# EAGLE design untitled (EAGLE 7.5.0)
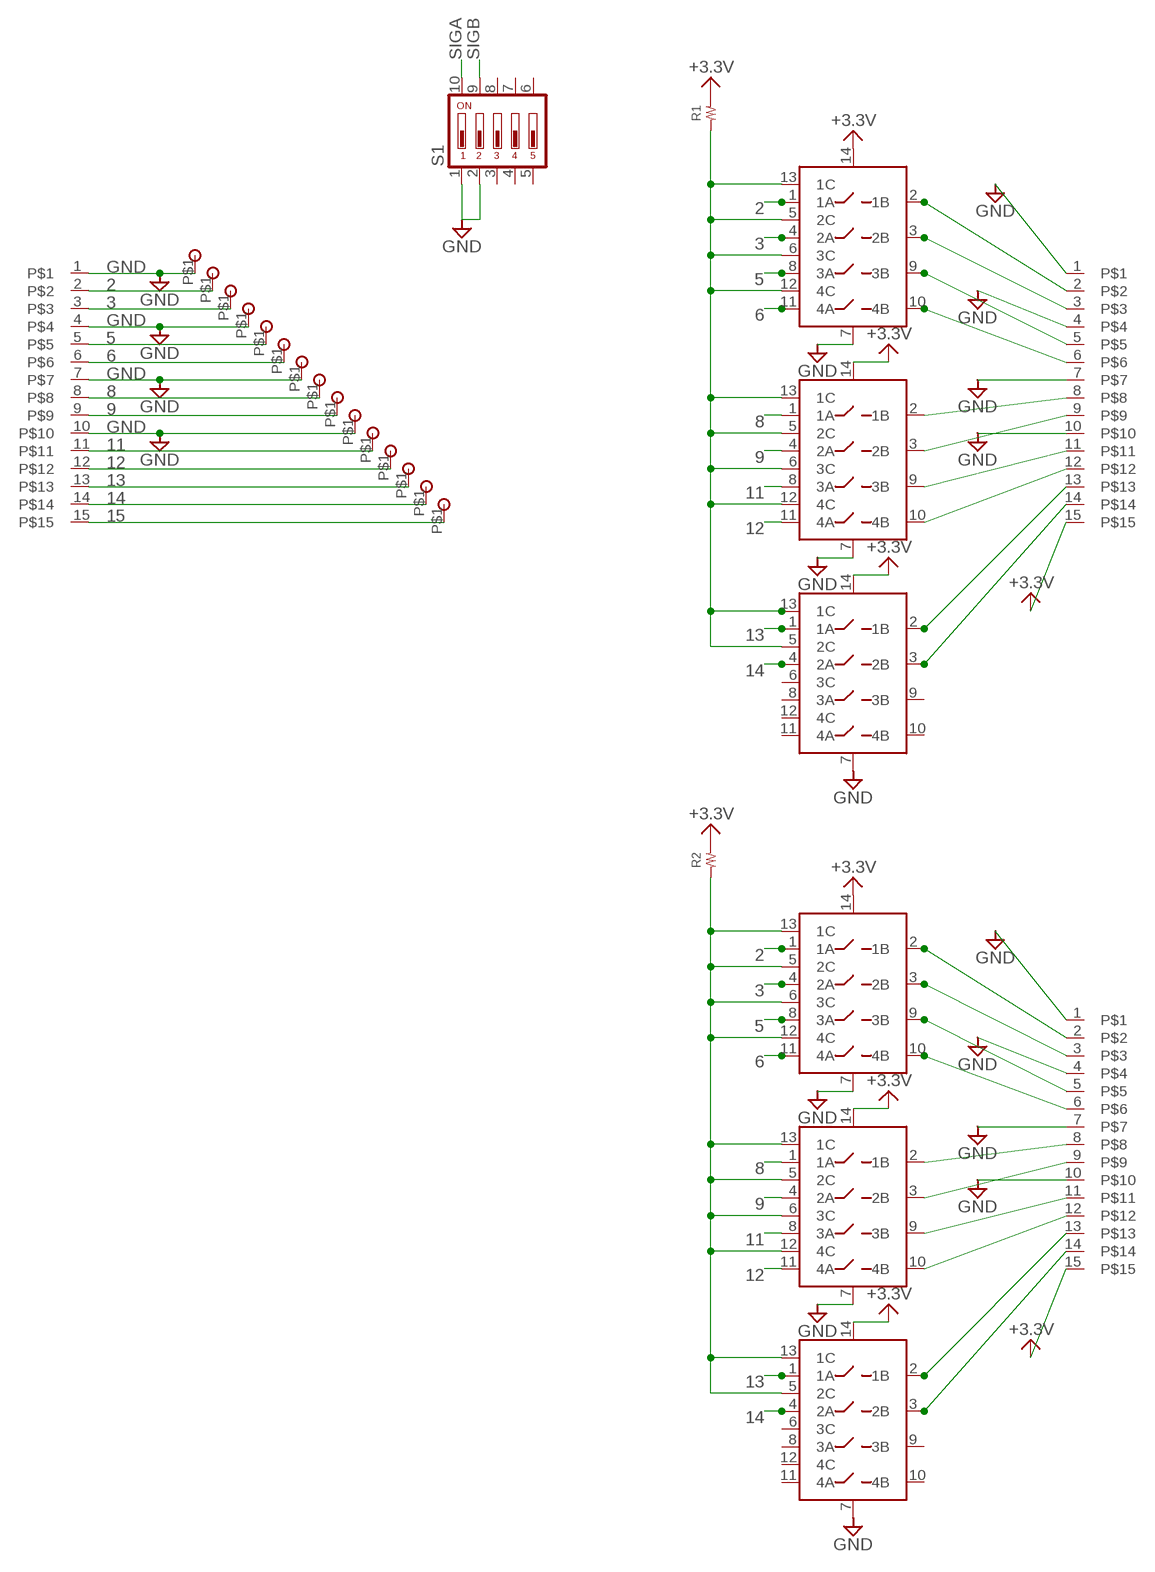
[diagram p0: schematic, sheet 1]

## Parts
A1  SN74HC4066  [DIL14]
A2  SN74HC4066  [DIL14]
A3  SN74HC4066  [DIL14]
A4  SN74HC4066  [DIL14]
A5  SN74HC4066  [DIL14]
A6  SN74HC4066  [DIL14]
C1  FMZ15  [FMZ15]
C2  FMZ15  [FMZ15]
R1  RESISTOR__SMD  [1608]
R2  RESISTOR__SMD  [1608]
RAS  FMZ15  [FMZ15]
S1  DIP05YL  [DIP05YL]
U$4  CHECK_0.8MM  [CHECK_0.8MM]
U$5  CHECK_0.8MM  [CHECK_0.8MM]
U$6  CHECK_0.8MM  [CHECK_0.8MM]
U$7  CHECK_0.8MM  [CHECK_0.8MM]
U$8  CHECK_0.8MM  [CHECK_0.8MM]
U$9  CHECK_0.8MM  [CHECK_0.8MM]
U$10  CHECK_0.8MM  [CHECK_0.8MM]
U$11  CHECK_0.8MM  [CHECK_0.8MM]
U$12  CHECK_0.8MM  [CHECK_0.8MM]
U$13  CHECK_0.8MM  [CHECK_0.8MM]
U$14  CHECK_0.8MM  [CHECK_0.8MM]
U$15  CHECK_0.8MM  [CHECK_0.8MM]
U$16  CHECK_0.8MM  [CHECK_0.8MM]
U$17  CHECK_0.8MM  [CHECK_0.8MM]
U$18  CHECK_0.8MM  [CHECK_0.8MM]

## Nets
2: A1.1(1A) A4.1(1A) RAS.2 U$5.P$1
3: A1.4(2A) A4.4(2A) RAS.3 U$6.P$1
5: A1.8(3A) A4.8(3A) RAS.5 U$8.P$1
6: A1.11(4A) A4.11(4A) RAS.6 U$9.P$1
8: A2.1(1A) A5.1(1A) RAS.8 U$11.P$1
9: A2.4(2A) A5.4(2A) RAS.9 U$12.P$1
11: A2.8(3A) A5.8(3A) RAS.11 U$14.P$1
12: A2.11(4A) A5.11(4A) RAS.12 U$15.P$1
13: A3.1(1A) A6.1(1A) RAS.13 U$16.P$1
14: A3.4(2A) A6.4(2A) RAS.14 U$17.P$1
15: RAS.15 U$18.P$1
+3.3V: A1.14(VCC) A2.14(VCC) A3.14(VCC) A4.14(VCC) A5.14(VCC) A6.14(VCC) C1.15 C2.15 R1.2 R2.2
GND: A1.7(GND) A2.7(GND) A3.7(GND) A4.7(GND) A5.7(GND) A6.7(GND) C1.1 C1.4 C1.7 C1.10 C2.1 C2.4 C2.7 C2.10 RAS.1 RAS.4 RAS.7 RAS.10 S1.1 S1.2 U$4.P$1 U$7.P$1 U$10.P$1 U$13.P$1
N$1: A4.2(1B) C2.2
N$2: A4.3(2B) C2.3
N$3: A4.9(3B) C2.5
N$4: A5.3(2B) C2.9
N$5: A5.2(1B) C2.8
N$6: A4.10(4B) C2.6
N$7: A1.2(1B) C1.2
N$8: A1.3(2B) C1.3
N$9: A6.3(2B) C2.14
N$10: A1.9(3B) C1.5
N$11: A6.2(1B) C2.13
N$12: A5.10(4B) C2.12
N$13: A5.9(3B) C2.11
N$17: A2.3(2B) C1.9
N$18: A2.2(1B) C1.8
N$20: A1.10(4B) C1.6
N$27: A3.3(2B) C1.14
N$28: A3.2(1B) C1.13
N$29: A2.10(4B) C1.12
N$30: A2.9(3B) C1.11
SIGA: A1.5(2C) A1.6(3C) A1.12(4C) A1.13(1C) A2.5(2C) A2.6(3C) A2.12(4C) A2.13(1C) A3.5(2C) A3.13(1C) R1.1 S1.10
SIGB: A4.5(2C) A4.6(3C) A4.12(4C) A4.13(1C) A5.5(2C) A5.6(3C) A5.12(4C) A5.13(1C) A6.5(2C) A6.13(1C) R2.1 S1.9
Unconnected: A3.6(3C) A3.8(3A) A3.9(3B) A3.10(4B) A3.11(4A) A3.12(4C) A6.6(3C) A6.8(3A) A6.9(3B) A6.10(4B) A6.11(4A) A6.12(4C) S1.3 S1.4 S1.5 S1.6 S1.7 S1.8

## Library data of the parts
A1-A6 = 04_IC:SN74HC4066
C1 C2 RAS = 08_CONECTOR:FMZ15
R1 R2 = 01_R:RESISTOR__SMD
S1 = 09_1_switch:DIP05YL: DIL/CODE SWITCH; OC_FARNELL: unknown; OC_NEWARK: unknown
U$4-U$18 = 08_CONECTOR:CHECK_0.8MM

## Board
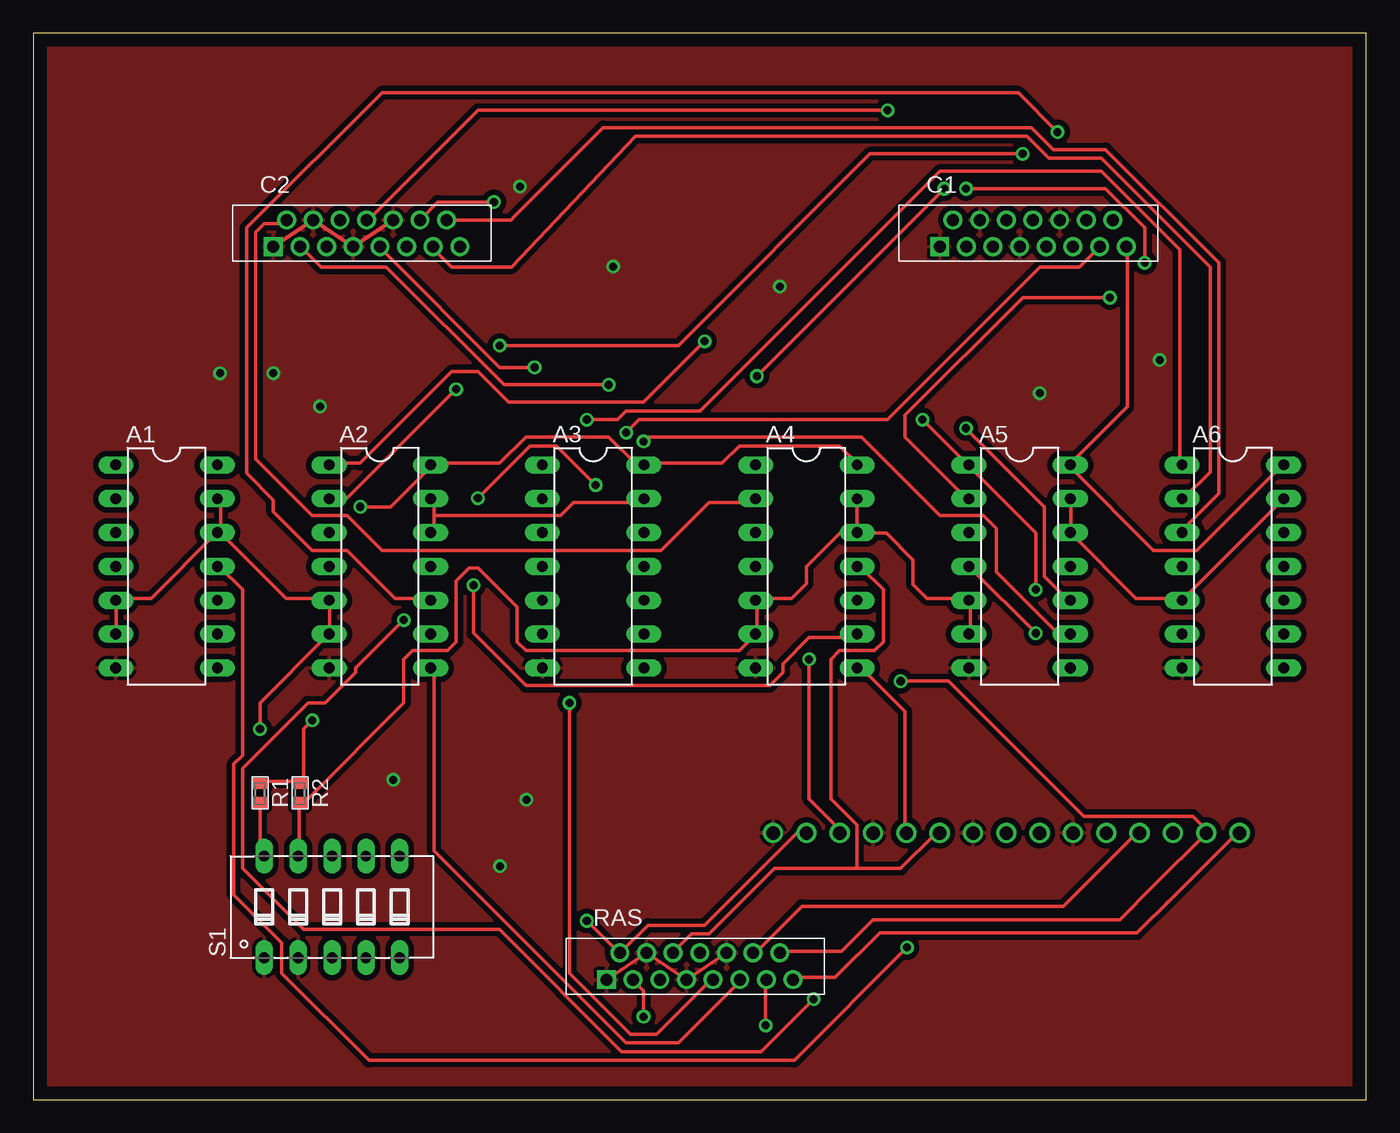
[diagram p1: board, top side]
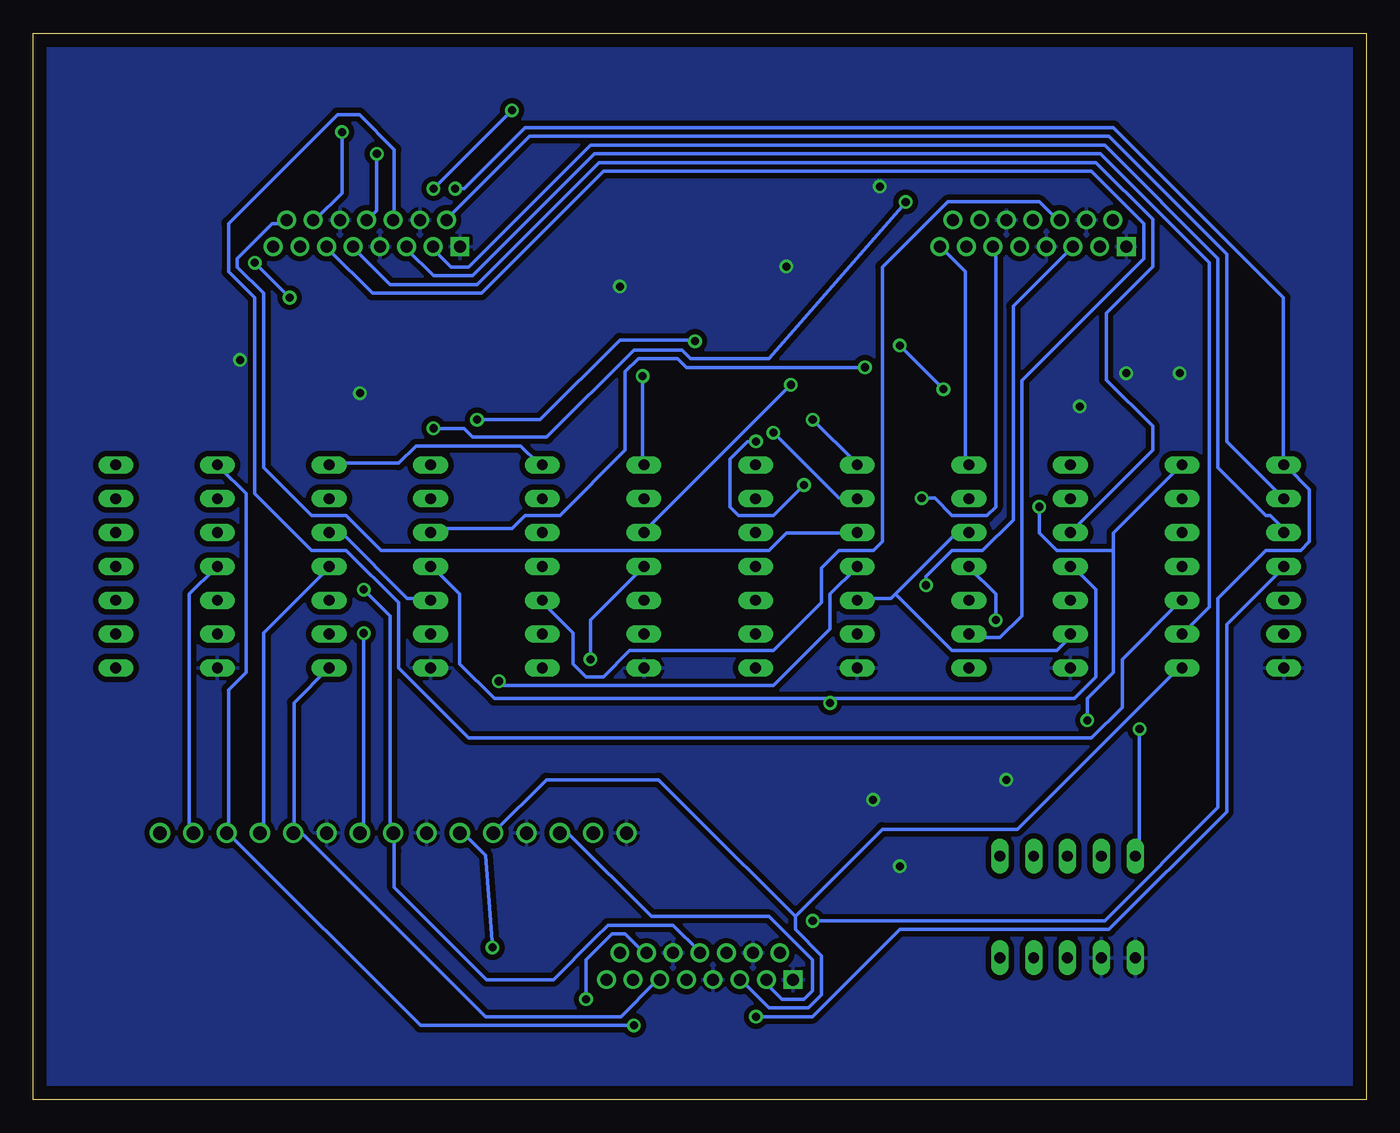
[diagram p2: board, bottom side, seen from below]

Size 100 x 80 mm. Coordinates in mm from the lower left corner, seen from the top.
Outline: 0,0 100,0 100,80 0,80 0,0
Copper layers (1*16): Top 0.035mm / dielectric 1.5mm / Bottom 0.035mm
Design rules "tiisai yatu": minimum track width 10mil, minimum drill 24mil, track to track 0.4mm, track to pad 0.4mm, pad to pad 0.4mm, via to via 0.4mm, smd to smd 0.4mm, copper to edge 40mil, drill to drill 8mil, minimum pad ring 10mil, minimum via ring 8mil, stop-mask expansion 4mil, vias tented up to drill 0mil, thermal gap 10mil

### Footprints (pad centres in the part's own frame; a part is rotated, then mirrored left to right if it is on the bottom)
DIL14 = drill 0.813 long: 1 -7.62,-3.81; 2 -5.08,-3.81; 3 -2.54,-3.81; 4 0,-3.81; 5 2.54,-3.81; 6 5.08,-3.81; 7 7.62,-3.81; 8 7.62,3.81; 9 5.08,3.81; 10 2.54,3.81; 11 0,3.81; 12 -2.54,3.81; 13 -5.08,3.81; 14 -7.62,3.81
FMZ15 = drill 0.9 square: 1 -7,-1 | drill 0.9: 2 -6,1; 3 -5,-1; 4 -4,1; 5 -3,-1; 6 -2,1; 7 -1,-1; 8 0,1; 9 1,-1; 10 2,1; 11 3,-1; 12 4,1; 13 5,-1; 14 6,1; 15 7,-1
1608 = smd 0.8 x 1: 1 -0.7,0; 2 0.7,0
DIP05YL = drill 0.813 long: 1 -5.08,-3.81; 2 -2.54,-3.81; 3 0,-3.81; 4 2.54,-3.81; 5 5.08,-3.81; 6 5.08,3.81; 7 2.54,3.81; 8 0,3.81; 9 -2.54,3.81; 10 -5.08,3.81
CHECK_0.8MM = drill 1: P$1 0,0

### Placement (x,y rotation side)
A1  10,40 270 top
A2  26,40 270 top
A3  42,40 270 top
A4  58,40 270 top
A5  74,40 270 top
A6  90,40 270 top
C1  75,65 0 top
C2  25,65 0 top
R1  17,23 90 top
R2  20,23 90 top
RAS  50,10 0 top
S1  22.41,14.45 0 top
U$4  55.5,20 180 top
U$5  58,20 180 top
U$6  60.5,20 180 top
U$7  63,20 180 top
U$8  65.5,20 180 top
U$9  68,20 180 top
U$10  70.5,20 180 top
U$11  73,20 180 top
U$12  75.5,20 180 top
U$13  78,20 180 top
U$14  80.5,20 180 top
U$15  83,20 180 top
U$16  85.5,20 180 top
U$17  88,20 180 top
U$18  90.5,20 180 top

### Tracks (layer width: path | path; a pad name or v marks a point on that pad's centre or on a via)
2  (via drill 0.61)
  Top 0.254: U$5.P$1 57.88,19.95 57.23,19.95 50.36,13.08 46.11,13.08 44.15,11.12 RAS.2 43.82,11.12 v41.53,13.41 | v68.34,68.34 v54.28,54.28
  Bottom 0.254: v41.53,13.41 19.62,13.41 11.12,21.91 11.12,37.6 7.52,41.2 4.91,41.2 4.25,41.86 4.25,45.78 5.89,47.41 A1.1 6.21,47.74 6.21,60.17 18.97,72.92 63.11,72.92 67.69,68.34 v68.34,68.34 | v54.28,54.28 54.28,47.74 A4.1
3  (via drill 0.61)
  Top 0.254: v45.78,6.21 45.78,8.18 45.13,8.83 RAS.3 | v58.21,33.03 58.21,22.56 60.49,20.27 U$6.P$1
  Bottom 0.254: U$6.P$1 60.49,19.95 59.84,19.95 53.63,13.73 44.8,13.73 41.53,10.46 41.53,8.18 42.18,7.52 43.82,7.52 45.13,8.83 RAS.3 | v45.78,6.21 41.53,6.21 34.99,12.75 19.29,12.75 10.46,21.58 10.46,35.64 6.21,39.89 A1.4 | v58.21,33.03 58.21,35.97 54.28,39.89 A4.4
5
  Top 0.254: U$8.P$1 65.4,20.27 65.4,29.1 62.13,32.37 A4.8
  Bottom 0.25: U$8.P$1 61.5,24 53.1,24 50.36,21.25
  Bottom 0.254: 42.84,13.73 36.3,20.27 26.16,20.27 14.06,32.37 A1.8 | 42.84,13.73 42.84,12.75 40.88,10.79 40.88,7.85 41.86,6.87 44.8,6.87 46.76,8.83 RAS.5 | 42.84,13.73 50.36,21.25
6  (via drill 0.61)
  Top 0.254: 61.8,17.33 55.59,17.33 50.69,12.43 49.38,12.43 48.07,11.12 RAS.6 | 61.8,17.33 65.07,17.33 67.69,19.95 U$9.P$1 | v65.55,11.41 57.09,2.94 25.18,2.94 18.64,9.48 18.64,11.77 15.04,15.37 15.04,25.18 15.7,25.83 15.7,38.26 14.06,39.89 A1.11 | 61.8,17.33 61.8,20.6 59.84,22.56 59.84,33.03 60.49,33.68 63.11,33.68 63.77,34.34 63.77,38.26 62.13,39.89 A4.11
  Bottom 0.254: v65.55,11.41 66.05,18.31 67.69,19.95 U$9.P$1
8  (via drill 0.61)
  Top 0.254: v50.36,56.9 45.78,52.32 35.64,52.32 33.35,54.61 31.39,54.61 24.52,47.74 22.24,47.74 A2.1 | v66.71,51.01 69.98,47.74 A5.1 70.31,47.41 75.21,42.51 v75.21,38.26
  Bottom 0.25: 57.88,12.1 60.98,9 66,9 72.92,15.92 72.92,18.64 | v66.71,51.01 61.99,51.01 56,57 50.46,57 v50.36,56.9
  Bottom 0.254: 72.92,18.64 72.92,19.95 U$11.P$1 73.25,20.27 73.25,36.3 v75.21,38.26 | 57.88,12.1 56.9,13.08 51.99,13.08 50.03,11.12 RAS.8
9  (via drill 0.61)
  Top 0.254: v75.21,34.99 70.31,39.89 A5.4 | v40.22,29.76 40.22,9.48 44.8,4.91 46.76,4.91 50.69,8.83 RAS.9
  Bottom 0.254: v75.21,34.99 75.21,20.27 U$12.P$1 | 40.22,30.08 65.4,30.08 68.02,32.7 68.02,37.93 69.98,39.89 A5.4 | 40.22,30.08 21.91,30.08 20.27,31.72 20.27,38.26 21.91,39.89 A2.4 | 40.22,30.08 v40.22,29.76
11
  Top 0.254: A2.8 30.08,32.37 30.08,18.64 44.47,4.25 48.4,4.25 52.97,8.83 RAS.11
  Bottom 0.254: A5.8 77.83,32.37 80.44,29.76 80.44,20.27 U$14.P$1 80.44,19.95 79.79,19.95 66.05,6.21 55.92,6.21 53.3,8.83 RAS.11
12  (via drill 0.61)
  Top 0.25: 54.28,11.12 57.66,14.5 77.28,14.5 79.46,16.68
  Top 0.254: v27.8,35.97 24.2,32.37 24.2,32.05 21.91,29.76 20.6,29.76 15.7,24.85 15.7,17.33 20.27,12.75 34.99,12.75 44.15,3.6 54.61,3.6 v58.53,7.52 | 79.46,16.68 82.73,19.95 U$15.P$1 | 54.28,11.12 RAS.12
  Bottom 0.254: U$15.P$1 82.73,20.27 82.73,34.99 77.83,39.89 A5.11 | v27.8,35.97 27.8,37.93 29.76,39.89 A2.11 | v58.53,7.52 58.53,10.46 56.57,12.43 55.59,12.43 54.28,11.12 RAS.12
13  (via drill 0.61)
  Top 0.254: v41.53,51.01 43.82,51.01 44.47,51.67 50.03,51.67 68.02,69.65 80.11,69.65 86,63.77 86,47.74 A6.1 | v54.94,5.56 54.94,8.83 RAS.13
  Bottom 0.254: A6.1 86,47.41 84.04,45.45 84.04,32.05 85.35,30.74 85.35,20.27 U$16.P$1 85.35,19.95 70.96,5.56 v54.94,5.56 | v41.53,51.01 38.26,47.74 A3.1
14  (via drill 0.61)
  Top 0.25: 56.24,11.12 60.62,11.12 63,13.5 81.52,13.5 84.04,16.02
  Top 0.254: v65.07,31.39 68.67,31.39 78.81,21.25 86.98,21.25 87.96,20.27 U$17.P$1 87.96,19.95 84.04,16.02 | 56.24,11.12 RAS.14
  Bottom 0.254: U$17.P$1 88.29,20.27 88.29,37.93 86.33,39.89 A6.4 | v65.07,31.39 64.75,31.07 44.47,31.07 40.22,35.32 40.22,37.93 38.26,39.89 A3.4
15
  Top 0.25: 57.23,9.16 60.16,9.16 63.5,12.5 82.81,12.5 85.4,15.1
  Top 0.254: 85.02,14.71 85.4,15.1 90.25,19.95 U$18.P$1 | 57.23,9.16 RAS.15
+3.3V  (via drill 0.61)
  Top 0.254: R1.2 17,23.87 19.95,23.87 R2.2 20.27,23.87 20.27,27.8 v20.93,28.45 | A4.14 61.8,47.74 60.49,49.05 52.97,49.05 51.67,47.74 46.11,47.74 A3.14 45.78,47.74 45.13,47.74 43.16,49.7 36.95,49.7 34.99,47.74 30.08,47.74 A2.14 29.76,47.41 26.81,44.47 v24.52,44.47 | A6.14 93.52,47.41 87.31,41.2 84.04,41.2 77.83,47.41 A5.14 77.83,47.74 82.08,51.99 82.08,63.77 C1.15
  Bottom 0.254: v20.93,28.45 20.93,30.08 18.97,32.05 18.97,41.2 | 18.97,41.2 18.97,42.51 14.06,47.41 A1.14 | A2.14 30.08,47.74 30.08,62.13 31.72,63.77 C2.15 | A5.14 77.5,47.74 72.59,47.74 71.29,49.05 63.44,49.05 62.13,47.74 A4.14 | 18.97,41.2 23.22,41.2 24.52,42.51 v24.52,44.47
GND  (via drill 0.6)
  Top 0.25: RAS.1 RAS.4 RAS.7 RAS.10 | C2.1 C2.4 C2.7 C2.10
  other vias: 18,54.5 14,54.5 21.5,52 37,22.5 35,17.5 43.5,62.5 36.5,68.5 56,61 75.5,53 27,24 84.5,55.5
  pour Bottom: 0,80 100,80 100,0 0,0
  pour Top: 0,80 100,80 100,-1 0,-1
N$1
  Top 0.254: A4.2 53.95,44.8 50.69,44.8 47.09,41.2 26.16,41.2 23.54,43.82 20.93,43.82 16.68,48.07 16.68,65.07 17.33,65.73 18.97,65.73 C2.2
N$2  (via drill 0.61)
  Top 0.254: v43.16,53.63 35.32,53.63 26.49,62.46 21.58,62.46 20.27,63.77 C2.3
  Bottom 0.254: v43.16,53.63 53.95,42.84 A4.3
N$3  (via drill 0.61)
  Top 0.254: v33.03,38.59 33.03,34.99 36.95,31.07 55.26,31.07 56.24,32.05 56.24,32.7 58.21,34.66 61.8,34.66 A4.9
  Bottom 0.254: v33.03,38.59 33.03,39.24 31.07,41.2 28.78,41.2 26.49,43.49 26.49,59.51 22.24,63.77 C2.5
N$4  (via drill 0.61)
  Top 0.254: v37.6,54.94 34.99,54.94 26.16,63.77 C2.9
  Bottom 0.254: v37.6,54.94 51.01,54.94 51.67,55.59 54.61,55.59 55.59,54.61 55.59,48.72 60.49,43.82 63.11,43.82 64.09,42.84 69.98,42.84 A5.3
N$5  (via drill 0.61)
  Top 0.254: v80.77,60.17 74.23,60.17 65.4,51.34 65.4,49.7 69.98,45.13 A5.2 | v83.39,62.78 83.39,65.4 80.44,68.34 v69.98,68.34 | v64.09,74.23 33.35,74.23 25.18,66.05 C2.8
  Bottom 0.254: v83.39,62.78 v80.77,60.17 | v64.09,74.23 v69.98,68.34
N$6
  Bottom 0.254: A4.10 61.8,37.28 59.51,34.99 59.51,32.7 58.53,31.72 57.23,31.72 55.26,33.68 44.47,33.68 40.88,37.28 40.88,39.89 39.57,41.2 36.95,41.2 36.3,41.86 36.3,62.46 31.39,67.36 24.52,67.36 23.22,66.05 C2.6
N$7
  Bottom 0.254: A1.2 6.21,45.13 10.46,49.38 10.46,63.44 19.29,72.27 62.78,72.27 69,66.05 C1.2
N$8
  Bottom 0.254: A1.3 6.21,42.84 7.19,43.82 7.52,43.82 11.12,47.41 11.12,63.11 19.62,71.61 58.21,71.61 67.36,62.46 68.67,62.46 69.98,63.77 C1.3
N$9
  Top 0.25: C2.14 35.84,66 36.06,66.23
  Top 0.254: 36.06,66.23 42.76,72.92 74.88,72.92 76.52,71.29 80.44,71.29 88.94,62.78 88.94,45.45 86.33,42.84 A6.3
N$10
  Bottom 0.254: A1.9 13.73,34.99 11.77,36.95 11.77,62.78 19.95,70.96 57.88,70.96 67.03,61.8 69.98,61.8 71.94,63.77 C1.5
N$11
  Top 0.254: A6.2 86.33,45.13 88.29,47.09 88.29,62.46 80.11,70.63 76.19,70.63 74.56,72.27 45.18,72.27 35.87,62.46 31.39,62.46 30.08,63.77 C2.13
N$12  (via drill 0.61)
  Top 0.25: C2.12 30.34,67.34 v34.55,67.34
  Top 0.254: v69.98,50.36 75.86,44.47 75.86,39.24 77.5,37.6 A5.10
  Bottom 0.254: v69.98,50.36 67.69,50.36 67.03,49.7 61.48,49.7 54.94,56.24 51.34,56.24 50.69,55.59 44.8,55.59 v34.55,67.34
N$13  (via drill 0.61)
  Top 0.254: v45.78,49.38 46.11,49.7 62.13,49.7 68.02,43.82 71.29,43.82 72.27,42.84 72.27,39.57 76.84,34.99 77.5,34.99 A5.9 | v42.18,46.11 39.24,49.05 37.28,49.05 v33.35,45.13
  Bottom 0.254: v45.78,49.38 46.43,49.38 47.74,48.07 47.74,44.47 47.09,43.82 44.47,43.82 v42.18,46.11 | v33.35,45.13 32.37,45.13 31.07,43.82 28.45,43.82 27.8,44.47 27.8,63.77 C2.11
N$17
  Bottom 0.25: 16.02,48.72 16.02,50.52 19.5,54 19.5,59 16.02,62.48 16.02,66.05
  Bottom 0.254: 16.02,48.72 21.91,42.84 A2.3 | 16.02,66.05 20.27,70.31 57.55,70.31 66.71,61.15 73.25,61.15 75.86,63.77 C1.9
N$18  (via drill 0.61)
  Top 0.254: v31.72,53.3 23.54,45.13 22.24,45.13 A2.2 | v34.99,56.57 48.4,56.57 62.78,70.96 v74.23,70.96
  Bottom 0.254: v34.99,56.57 v31.72,53.3 | v74.23,70.96 74.23,66.71 74.88,66.05 C1.8
N$20
  Bottom 0.254: A1.10 14.06,37.28 18.31,33.03 18.31,29.43 20.6,27.14 67.36,27.14 72.59,32.37 72.59,37.28 76.52,41.2 79.13,41.2 83.39,45.45 83.39,60.17 85.35,62.13 85.35,65.73 77.17,73.9 75.54,73.9 72.92,71.29 72.92,66.05 C1.6
N$27
  Bottom 0.254: A3.3 38.26,42.51 43.49,42.51 44.8,41.2 73.9,41.2 76.52,43.82 79.13,43.82 82.73,47.41 82.73,60.49 84.69,62.46 84.69,63.11 82.08,65.73 81.1,65.73 C1.14
N$28  (via drill 0.61)
  Top 0.254: v44.47,50.03 45.45,51.01 64.09,51.01 75.54,62.46 78.48,62.46 79.79,63.77 C1.13
  Bottom 0.254: v44.47,50.03 39.57,45.13 38.26,45.13 A3.2
N$29  (via drill 0.61)
  Top 0.25: 20.93,41.2 18,44.13 18,45 16,47 16,65.38 16.02,65.4
  Top 0.254: 20.93,41.2 23.54,41.2 27.14,37.6 29.76,37.6 A2.10 | 16.02,65.4 26.16,75.54 73.9,75.54 v76.84,72.59
  Bottom 0.254: v76.84,72.59 76.84,68.02 78.81,66.05 C1.12
N$30
  Bottom 0.254: A2.9 29.76,34.66 27.47,34.66 25.83,36.3 25.83,53.95 16.68,63.11 16.68,65.73 20.6,69.65 57.23,69.65 66.38,60.49 74.56,60.49 77.83,63.77 C1.11
SIGA  (via drill 0.61)
  Top 0.254: 30.08,43.82 30.08,44.8 A2.13 | 30.08,43.82 30.08,42.84 A2.12 | 30.08,43.82 39.57,43.82 40.55,44.8 45.78,44.8 A3.13 | R1.1 17,22.24 17,18.31 S1.10 | A1.6 6.21,34.99 6.21,37.28 A1.5 6.21,37.6 8.83,37.6 13.73,42.51 A1.12 | A1.12 14.06,42.84 14.06,44.8 A1.13 | A1.12 14.06,42.51 18.97,37.6 21.91,37.6 A2.5 22.24,37.28 22.24,34.99 A2.6 21.91,34.66 17,29.76 v17,27.8
  Bottom 0.254: 35.32,37.93 30.74,42.51 30.08,42.51 A2.12 | 35.32,37.93 35.64,37.6 37.93,37.6 A3.5 | v17,27.8 17,18.31 S1.10 | 35.32,37.93 31.07,33.68 23.22,33.68 22.24,34.66 A2.6
SIGB
  Top 0.25: 56.9,37.6 58,38.71 58,40 60.54,42.54 A4.12 | 62.13,42.51 63.99,42.51 66,40.5 66,38.64 67.03,37.6
  Top 0.254: A6.13 93.52,44.8 86.33,37.6 A6.5 86,37.6 82.73,37.6 77.83,42.51 A5.12 77.83,42.84 77.83,44.8 A5.13 | A5.6 70.31,34.99 70.31,37.28 A5.5 69.98,37.6 67.03,37.6 | S1.9 19.95,18.31 19.95,22.24 R2.1 20.27,22.56 20.6,22.56 27.8,29.76 27.8,33.03 28.45,33.68 31.07,33.68 31.72,34.34 31.72,38.91 32.7,39.89 33.35,39.89 36.3,36.95 36.3,34.34 36.95,33.68 52.97,33.68 53.95,34.66 A4.6 54.28,34.99 54.28,37.28 A4.5 54.28,37.6 56.9,37.6 | A4.12 61.8,42.84 61.8,44.8 A4.13 | 61.8,42.51 A4.12 | 62.13,42.51 A4.12
  Bottom 0.254: A5.5 70.31,37.6 71.94,37.6 76.84,42.51 77.5,42.51 A5.12